# EAGLE design scanner_ps_nameco (EAGLE 5.10)
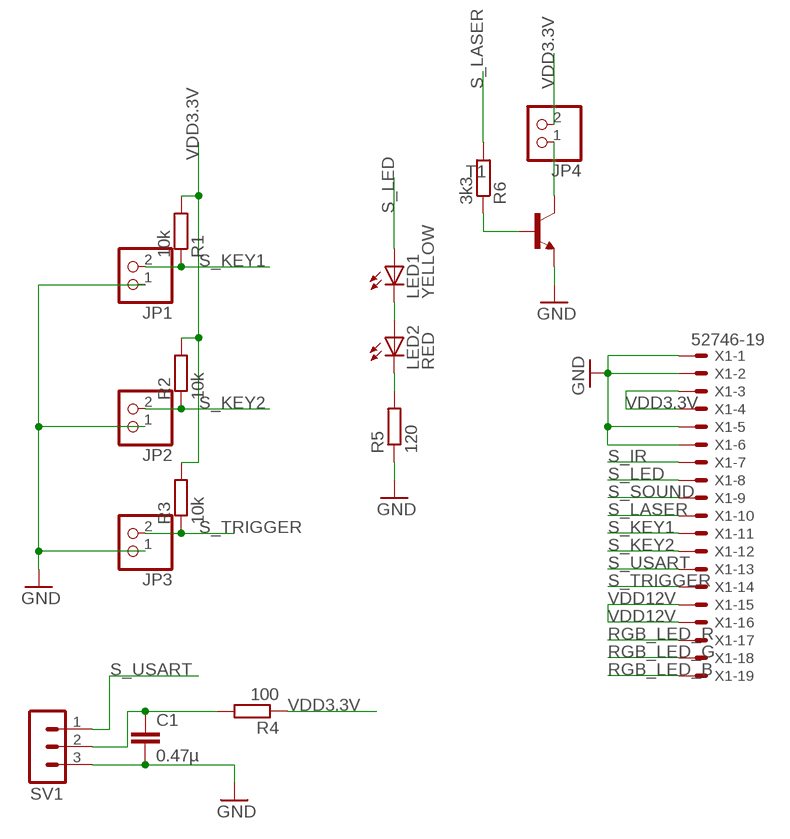
[diagram p0: schematic, sheet 1]

## Parts
C1  0.47µ  C-EUC0805  [C0805]
JP1  PINHD-1X2  [1X02]
JP2  PINHD-1X2  [1X02]
JP3  PINHD-1X2  [1X02]
JP4  PINHD-1X2  [1X02]
LED1  YELLOW  LED3MM  [LED3MM]
LED2  RED  LED3MM  [LED3MM]
R1  10k  R-EU_0204/7  [0204/7]
R2  10k  R-EU_0204/7  [0204/7]
R3  10k  R-EU_0204/7  [0204/7]
R4  100  R-EU_M0805  [M0805]
R5  120  R-EU_M0805  [M0805]
R6  3k3  R-EU_0204/7  [0204/7]
SV1  MA03-1  [MA03-1]
T1  BC847C-NPN-SOT23-BEC  [SOT23-BEC]
X1  52746-19  [52746-19]

## Nets
GND: C1.2 JP1.1 JP2.1 JP3.1 R5.1 SV1.3 T1.E X1.1 X1.2 X1.5 X1.6
N$1: LED1.K(C) LED2.A
N$2: LED2.K(C) R5.2
N$3: C1.1 R4.2 SV1.2
N$4: R6.1 T1.B
N$5: JP4.1 T1.C
RGB_LED_B: X1.19
RGB_LED_G: X1.18
RGB_LED_R: X1.17
S_IR: X1.7
S_KEY1: JP1.2 R1.1 X1.11
S_KEY2: JP2.2 R2.1 X1.12
S_LASER: R6.2 X1.10
S_LED: LED1.A X1.8
S_SOUND: X1.9
S_TRIGGER: JP3.2 R3.1 X1.14
S_USART: SV1.1 X1.13
VDD3.3V: JP4.2 R1.2 R2.2 R3.2 R4.1 X1.3 X1.4
VDD12V: X1.15 X1.16

## Library data of the parts
C1 = rcl:C-EU: CAPACITOR, European symbol
JP1-JP4 = pinhead:PINHD-1X2: PIN HEADER
LED1 LED2 = led:LED: LED OSRAM: - CHIPLED LG R971, LG N971, LY N971, LG Q971, LY Q971, LO R971, LY R971 LH N974, LH R974 LS Q976, LO Q976, LY Q976 LO Q996 - Hyper CHIPLED LW Q18S LB Q993, LB Q99A, LB R99A - SideLED LS A670, LO A670, LY A670, LG A670, LP A670 LB A673, LV A673, LT A673, LW A673 LH A674 LY A675 LS A676, LA A676, LO A676, LY A676, LW A676 LS A679, LY A679, LG A679 - Hyper Micro SIDELED® LS Y876, LA Y876, LO Y876, LY Y876 LT Y87S - SmartLED LW L88C, LW L88S LB L89C, LB L89S, LG L890 LS L89K, LO L89K, LY L89K LS L896, LA L896, LO L896, LY L896 - TOPLED LS T670, LO T670, LY T670, LG T670, LP T670 LSG T670, LSP T670, LSY T670, LOP T670, LYG T670 LG T671, LOG T671, LSG T671 LB T673, LV T673, LT T673, LW T673 LH T674 LS T676, LA T676, LO T676, LY T676, LB T676, LH T676, LSB T676, LW T676 LB T67C, LV T67C, LT T67C, LS T67K, LO T67K, LY T67K, LW E67C LS E67B, LA E67B, LO E67B, LY E67B, LB E67C, LV E67C, LT E67C LW T67C LS T679, LY T679, LG T679 LS T770, LO T770, LY T770, LG T770, LP T770 LB T773, LV T773, LT T773, LW T773 LH T774 LS E675, LA E675, LY E675, LS T675 LS T776, LA T776, LO T776, LY T776, LB T776 LHGB T686 LT T68C, LB T68C - Hyper Mini TOPLED® LB M676 - Mini TOPLED Santana® LG M470 LS M47K, LO M47K, LY M47K Source: http://www.osram.convergy.de LUXEON: - LUMILED® LXK2-PW12-R00, LXK2-PW12-S00, LXK2-PW14-U00, LXK2-PW14-V00 LXK2-PM12-R00, LXK2-PM12-S00, LXK2-PM14-U00 LXK2-PE12-Q00, LXK2-PE12-R00, LXK2-PE12-S00, LXK2-PE14-T00, LXK2-PE14-U00 LXK2-PB12-K00, LXK2-PB12-L00, LXK2-PB12-M00, LXK2-PB14-N00, LXK2-PB14-P00, LXK2-PB14-Q00 LXK2-PR12-L00, LXK2-PR12-M00, LXK2-PR14-Q00, LXK2-PR14-R00 LXK2-PD12-Q00, LXK2-PD12-R00, LXK2-PD12-S00 LXK2-PH12-R00, LXK2-PH12-S00 LXK2-PL12-P00, LXK2-PL12-Q00, LXK2-PL12-R00 Source: www.luxeon.com KINGBRIGHT: KA-3528ASYC Source: www.kingbright.com
R1-R6 = rcl:R-EU_: RESISTOR, European symbol
SV1 = con-lstb:MA03-1: PIN HEADER
T1 = transistor:*-NPN-: NPN Transistror BF959 corrected 2008.03.06
X1 = con-molex:52746-19: FPC Connector ZIF for SMT 0.5mm Source: http://www.farnell.com/datasheets/73044.pdf [DWG. NO. (Sheet 1 OF 2) SD-52746-**17]

## Board
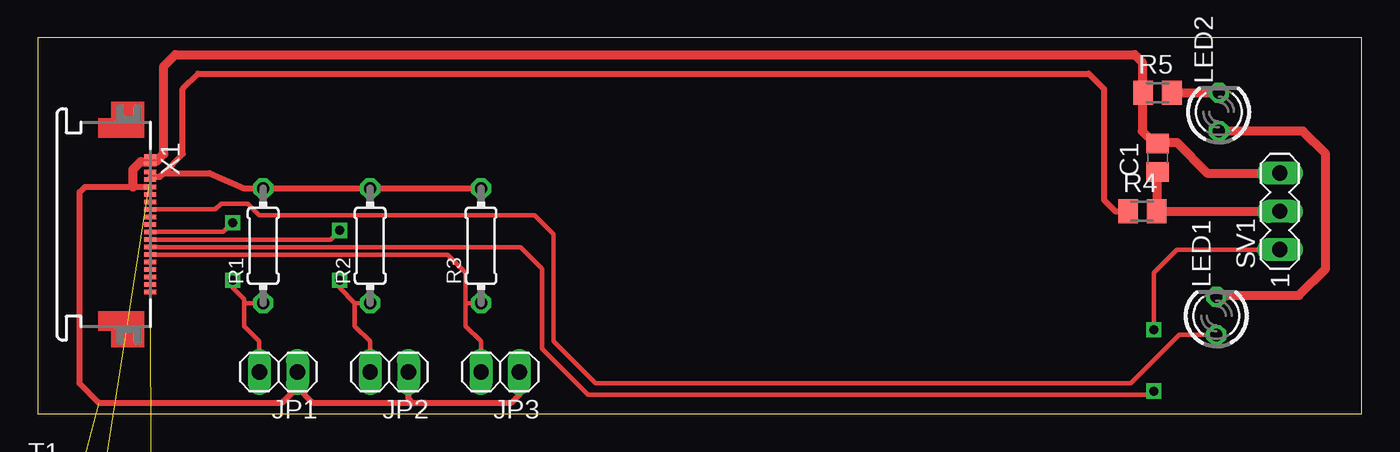
[diagram p1: board, top side]
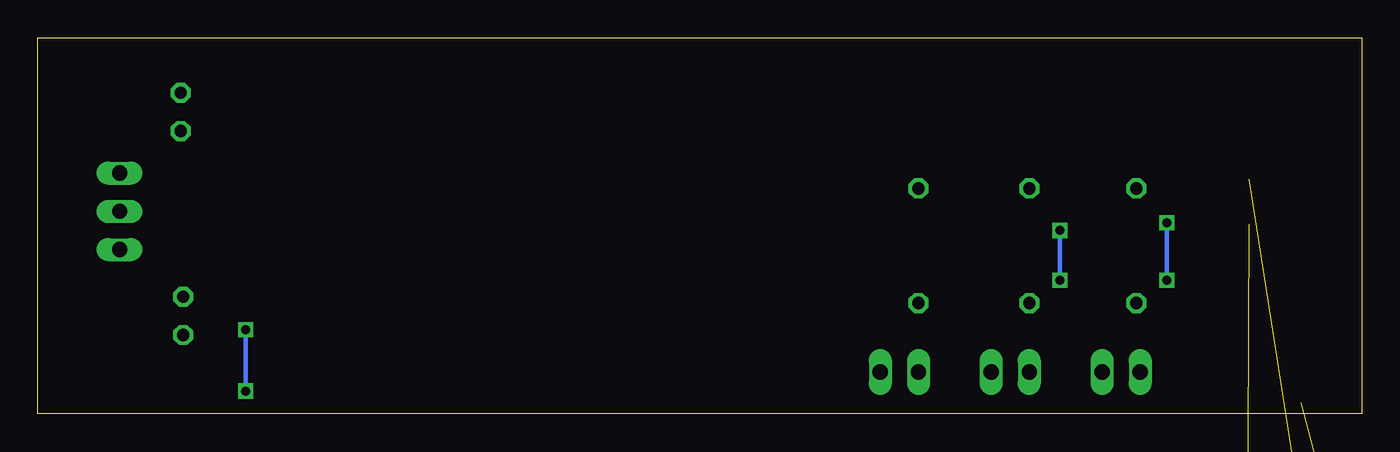
[diagram p2: board, bottom side, seen from below]

Size 88 x 25 mm. Coordinates in mm from the lower left corner, seen from the top.
Outline: 0,0 88,0 88,25 0,25 0,0
Copper layers (1*16): Top 0.035mm / dielectric 1.5mm / Bottom 0.035mm
Design rules "default": minimum track width 10mil, minimum drill 24mil, track to track 8mil, track to pad 8mil, pad to pad 8mil, via to via 8mil, smd to smd 8mil, copper to edge 40mil, drill to drill 8mil, minimum pad ring 10mil, minimum via ring 8mil, stop-mask expansion 4mil, vias tented up to drill 0mil, thermal gap 10mil

### Footprints (pad centres in the part's own frame; a part is rotated, then mirrored left to right if it is on the bottom)
C0805 = smd 1.3 x 1.5: 1 -0.95,0; 2 0.95,0
1X02 = drill 1.016 long: 1 -1.27,0; 2 1.27,0
LED3MM = drill 0.813 octagon: A -1.27,0; K 1.27,0
0204/7 = drill 0.813 octagon: 1 -3.81,0; 2 3.81,0
M0805 = smd 1.3 x 1.6: 1 -0.95,0; 2 0.95,0
MA03-1 = drill 1.016 long: 1 -2.54,0; 2 0,0; 3 2.54,0
SOT23-BEC = smd 1 x 1.4: B -0.95,-1.1; C 0,1.1; E 0.95,-1.1
52746-19 = smd 0.3 x 0.8: 1 -4.5,0.6; 2 -4,0.6; 3 -3.5,0.6; 4 -3,0.6; 5 -2.5,0.6; 6 -2,0.6; 7 -1.5,0.6; 8 -1,0.6; 9 -0.5,0.6; 10 0,0.6; 11 0.5,0.6; 12 1,0.6; 13 1.5,0.6; 14 2,0.6; 15 2.5,0.6; 16 3,0.6; 17 3.5,0.6; 18 4,0.6; 19 4.5,0.6

### Placement (x,y rotation side)
C1  74.42,17.02 90 top
JP1  16,2.79 180 top
JP2  23.37,2.79 180 top
JP3  30.73,2.79 180 top
JP4  2.03,-11.18 0 top  (outside the outline)
LED1  78.33,6.52 90 top
LED2  78.49,20.06 90 top
R1  14.99,11.18 90 top
R2  22.1,11.18 90 top
R3  29.46,11.18 90 top
R4  73.41,13.46 0 top
R5  74.42,21.34 0 top
R6  3.81,-16.26 0 top  (outside the outline)
SV1  82.55,13.46 90 top
T1  1.27,-5.08 0 top  (outside the outline)
X1  6.89,12.59 270 top

### Tracks (layer width: path | path; a pad name or v marks a point on that pad's centre or on a via)
GND  (1 unrouted)
  Top 0.305: 7.69,17.09 X1.1 7.82,16.76 7.66,16.76 X1.2 | X1.5 X1.6
  Top 0.406: 17.27,1.78 18.29,0.76 24.89,0.76 | 24.89,0.76 31.5,0.76 32,1.27 JP3.1 | JP2.1 24.64,1.02 24.89,0.76 | 17.27,1.78 JP1.1 | 17.27,1.78 16.26,0.76 4.06,0.76 2.79,2.03 2.79,14.73 3.15,15.09 6.35,15.09 X1.5 | 73.41,21.4 R5.1 73.41,21.27 | 74.23,17.97 C1.2
  Top 0.61: SV1.3 77.72,16 75.69,18.03 74.49,18.03 C1.2 | 73.41,21.4 73.41,23.37 72.9,23.88 9.14,23.88 8.38,23.11 8.38,17.27 7.87,16.76 7.82,16.76 6.86,16.76 6.35,16.26 6.35,15.09 | 74.23,17.97 73.41,18.8 73.41,21.27
N$1
  Top 0.61: LED2.A 84.08,18.79 85.6,17.27 85.6,9.65 83.82,7.87 78.41,7.87 LED1.K
N$2
  Top 0.61: R5.2 LED2.K
N$3
  Top 0.61: SV1.2 R4.2 74.42,13.53 C1.1
N$4  (1 unrouted)
N$5  (1 unrouted)
S_KEY1  (via drill 0.6)
  Top 0.305: JP1.2 14.73,4.83 13.72,5.84 13.72,7.37 | 13.72,7.37 13.72,7.62 12.95,8.38 v12.95,8.89 | X1.11 12.34,12.09 v12.95,12.7 | 13.72,7.37 R1.1
  Bottom 0.305: v12.95,8.89 v12.95,12.7
S_KEY2  (via drill 0.6)
  Top 0.305: JP2.2 22.1,4.83 21.08,5.84 21.08,7.37 | X1.12 19.46,11.59 v20.07,12.19 | v20.07,8.89 20.07,8.38 21.08,7.37 | 21.08,7.37 R2.1
  Bottom 0.305: v20.07,12.19 v20.07,8.89
S_LASER  (1 unrouted)
S_LED
  Top 0.305: LED1.A 75.86,5.25 72.64,2.03 37.08,2.03 34.29,4.83 34.29,11.94 33.02,13.21 14.73,13.21 13.97,13.97 12.19,13.97 11.81,13.59 X1.8
S_TRIGGER
  Top 0.305: X1.14 27.26,10.59 28.45,9.4 28.45,7.37 | JP3.2 29.46,4.83 28.45,5.84 28.45,7.37 | 28.45,7.37 R3.1
S_USART  (via drill 0.6)
  Top 0.305: 82.38,11.09 SV1.1 75.69,10.92 74.17,9.4 v74.17,5.59 | X1.13 32.09,11.09 33.53,9.65 33.53,4.32 36.58,1.27 73.66,1.27 v74.17,1.52
  Bottom 0.305: v74.17,1.52 v74.17,5.59
VDD3.3V  (1 unrouted)
  Top 0.254: X1.4 X1.3
  Top 0.305: X1.4 7.65,15.75
  Top 0.406: R4.1 71.63,13.46 70.87,14.22 70.87,21.59 69.85,22.61 10.67,22.61 9.65,21.59 9.65,17.27 8.38,16 | 7.65,15.75 8.13,15.75 8.38,16 | R3.2 R2.2 R1.2 13.72,14.99 11.43,16 8.38,16
VDD12V  (1 unrouted)